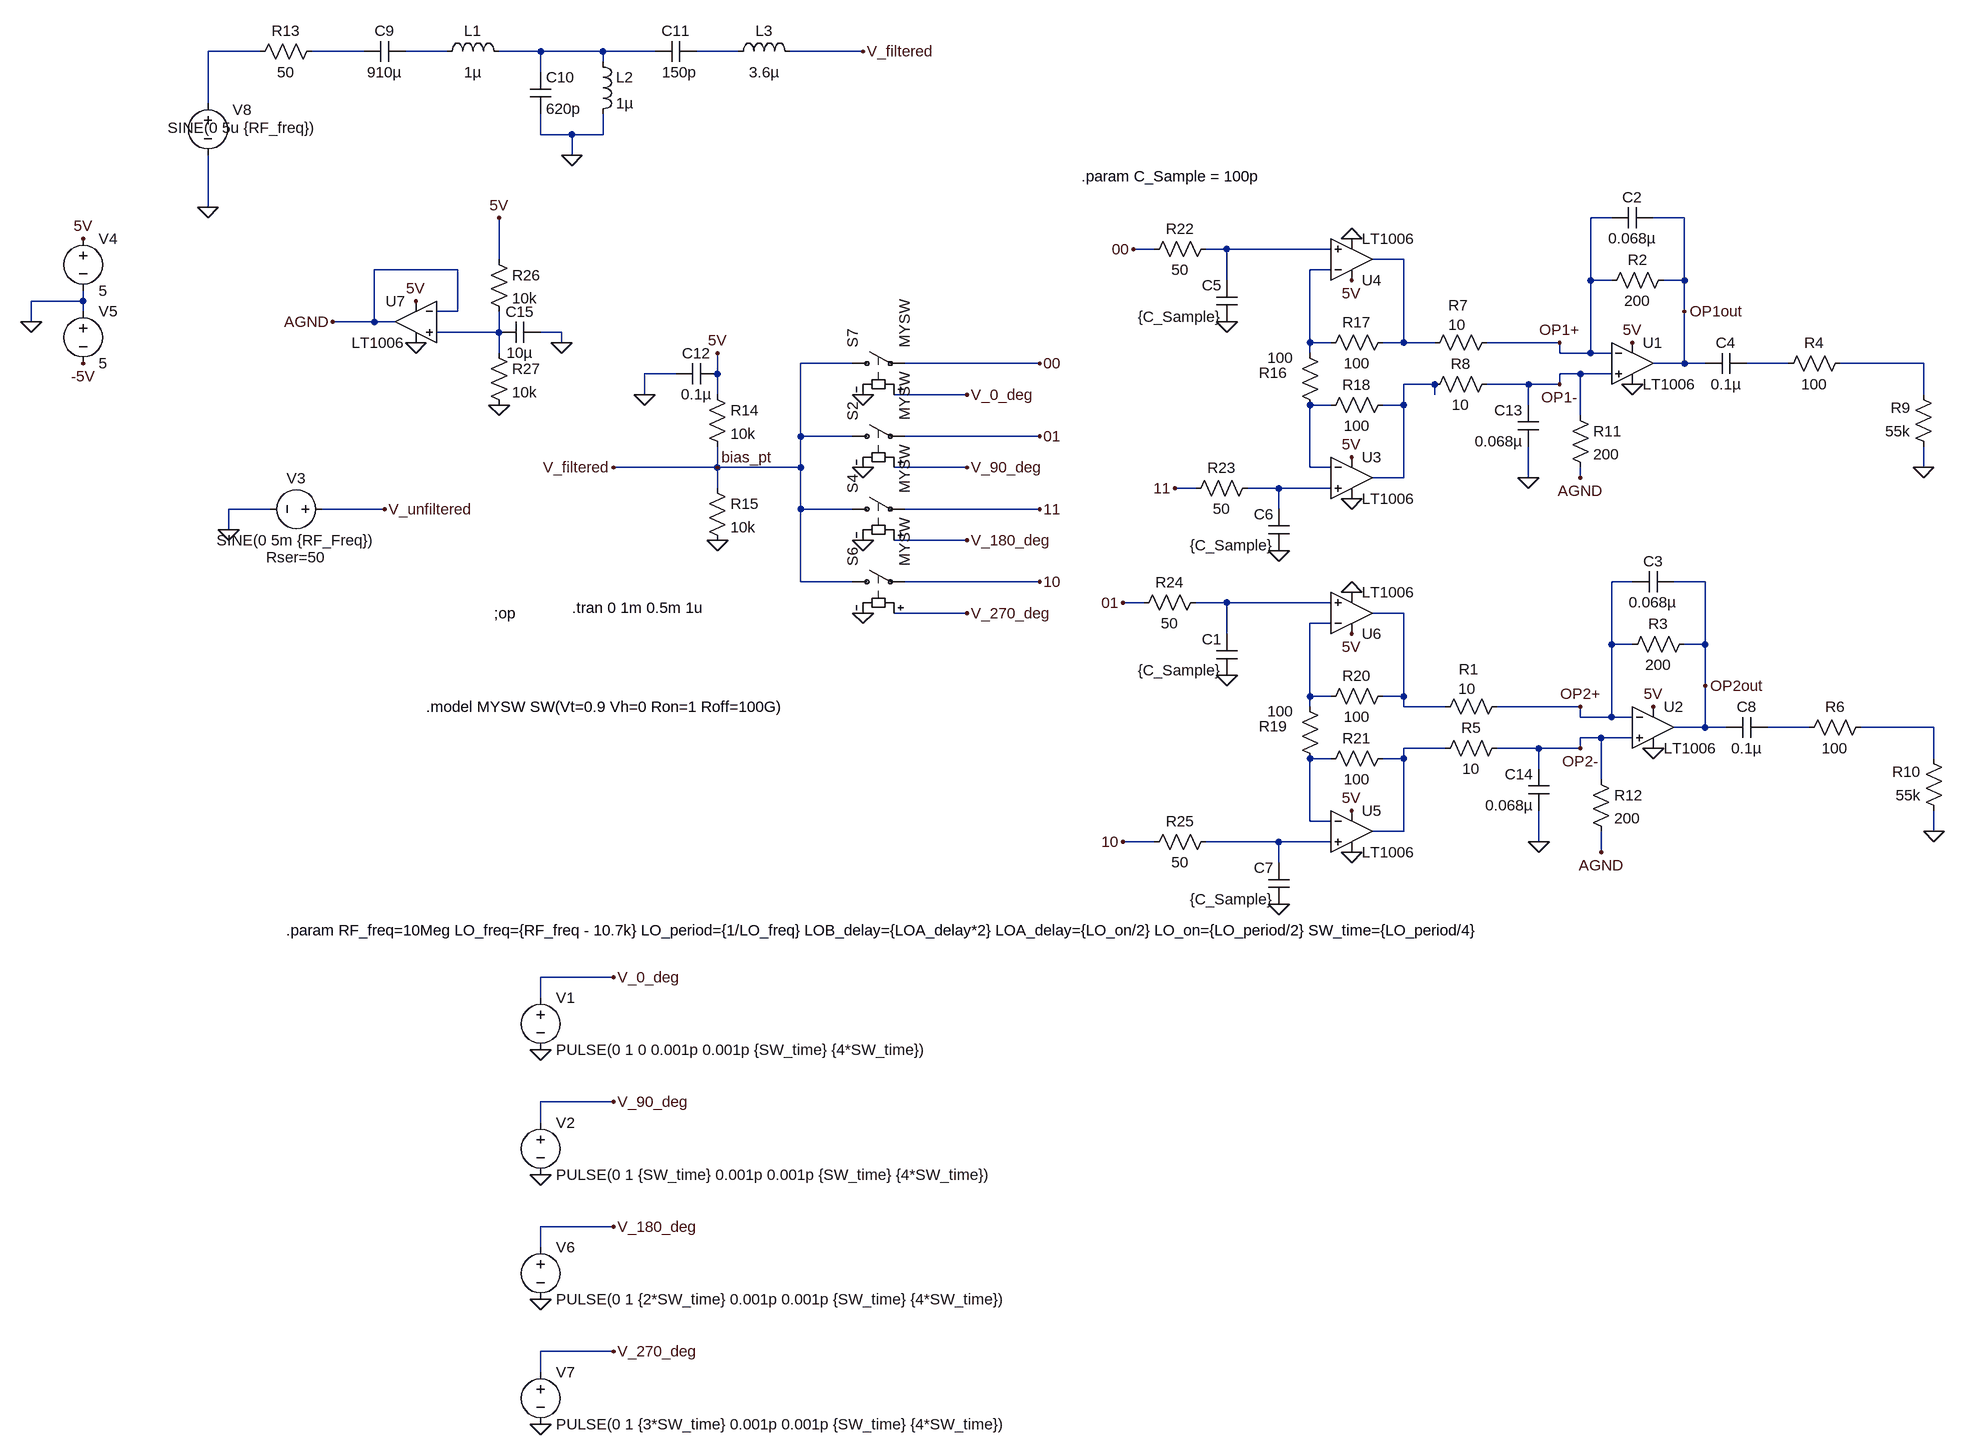
[diagram p0: schematic TayloeMixerSim.asc]
TayloeMixerSim.asc, the LTspice schematic file:
Version 4
SHEET 1 2720 1156
WIRE -784 -976 -864 -976
WIRE -624 -976 -704 -976
WIRE -496 -976 -560 -976
WIRE -352 -976 -416 -976
WIRE -256 -976 -352 -976
WIRE -176 -976 -256 -976
WIRE -48 -976 -112 -976
WIRE 144 -976 32 -976
WIRE -256 -960 -256 -976
WIRE -352 -944 -352 -976
WIRE -864 -896 -864 -976
WIRE -352 -848 -352 -880
WIRE -304 -848 -352 -848
WIRE -256 -848 -256 -880
WIRE -256 -848 -304 -848
WIRE -304 -816 -304 -848
WIRE -864 -736 -864 -816
WIRE 1296 -720 1264 -720
WIRE 1408 -720 1360 -720
WIRE 592 -672 560 -672
WIRE 704 -672 672 -672
WIRE 864 -672 704 -672
WIRE -416 -656 -416 -720
WIRE 976 -656 928 -656
WIRE -480 -640 -608 -640
WIRE 864 -640 832 -640
WIRE 704 -624 704 -672
WIRE 1264 -624 1264 -720
WIRE 1296 -624 1264 -624
WIRE 1408 -624 1408 -720
WIRE 1408 -624 1376 -624
WIRE -1056 -592 -1056 -608
WIRE -1056 -592 -1136 -592
WIRE -1056 -576 -1056 -592
WIRE -480 -576 -480 -640
WIRE -480 -576 -512 -576
WIRE 1408 -576 1408 -624
WIRE -1136 -560 -1136 -592
WIRE -608 -560 -608 -640
WIRE -608 -560 -672 -560
WIRE -576 -560 -608 -560
WIRE -416 -544 -416 -576
WIRE -416 -544 -512 -544
WIRE -320 -544 -352 -544
WIRE -320 -528 -320 -544
WIRE 832 -528 832 -640
WIRE 864 -528 832 -528
WIRE 976 -528 976 -656
WIRE 976 -528 944 -528
WIRE 1024 -528 976 -528
WIRE 1216 -528 1104 -528
WIRE -416 -512 -416 -544
WIRE 832 -512 832 -528
WIRE 1216 -512 1216 -528
WIRE 1264 -512 1264 -624
WIRE 1264 -512 1216 -512
WIRE 1296 -512 1264 -512
WIRE 128 -496 48 -496
WIRE 416 -496 208 -496
WIRE 1408 -496 1408 -576
WIRE 1408 -496 1360 -496
WIRE 1440 -496 1408 -496
WIRE 1568 -496 1504 -496
WIRE 1776 -496 1648 -496
WIRE -144 -480 -192 -480
WIRE -80 -480 -80 -512
WIRE 1248 -480 1216 -480
WIRE 1296 -480 1248 -480
WIRE 1024 -464 976 -464
WIRE 1168 -464 1104 -464
WIRE 1216 -464 1216 -480
WIRE 1216 -464 1168 -464
WIRE -192 -448 -192 -480
WIRE -80 -448 -80 -480
WIRE 304 -448 192 -448
WIRE 1024 -448 1024 -464
WIRE 1776 -448 1776 -496
WIRE 864 -432 832 -432
WIRE 976 -432 976 -464
WIRE 976 -432 944 -432
WIRE 1168 -432 1168 -464
WIRE 1248 -416 1248 -480
WIRE 48 -384 48 -496
WIRE 128 -384 48 -384
WIRE 416 -384 208 -384
WIRE -80 -336 -80 -368
WIRE -80 -336 -240 -336
WIRE 48 -336 48 -384
WIRE 48 -336 -80 -336
WIRE 304 -336 192 -336
WIRE 832 -336 832 -432
WIRE 864 -336 832 -336
WIRE 1776 -336 1776 -368
WIRE 976 -320 976 -432
WIRE 976 -320 928 -320
WIRE 1168 -320 1168 -368
WIRE 1248 -320 1248 -336
WIRE -80 -304 -80 -336
WIRE 656 -304 624 -304
WIRE 784 -304 736 -304
WIRE 864 -304 784 -304
WIRE -768 -272 -832 -272
WIRE -592 -272 -688 -272
WIRE 48 -272 48 -336
WIRE 128 -272 48 -272
WIRE 416 -272 208 -272
WIRE 784 -272 784 -304
WIRE -832 -240 -832 -272
WIRE 304 -224 192 -224
WIRE 48 -160 48 -272
WIRE 128 -160 48 -160
WIRE 416 -160 208 -160
WIRE 1328 -160 1296 -160
WIRE 1440 -160 1392 -160
WIRE 576 -128 544 -128
WIRE 704 -128 656 -128
WIRE 864 -128 704 -128
WIRE 304 -112 192 -112
WIRE 976 -112 928 -112
WIRE 864 -96 832 -96
WIRE 704 -80 704 -128
WIRE 1296 -64 1296 -160
WIRE 1328 -64 1296 -64
WIRE 1440 -64 1440 -160
WIRE 1440 -64 1408 -64
WIRE 1440 0 1440 -64
WIRE 832 16 832 -96
WIRE 864 16 832 16
WIRE 976 16 976 -112
WIRE 976 16 944 16
WIRE 832 32 832 16
WIRE 976 32 976 16
WIRE 1040 32 976 32
WIRE 1248 32 1120 32
WIRE 1248 48 1248 32
WIRE 1296 48 1296 -64
WIRE 1296 48 1248 48
WIRE 1328 48 1296 48
WIRE 1440 64 1440 0
WIRE 1440 64 1392 64
WIRE 1472 64 1440 64
WIRE 1600 64 1536 64
WIRE 1792 64 1680 64
WIRE 1280 80 1248 80
WIRE 1328 80 1280 80
WIRE 1040 96 976 96
WIRE 1184 96 1120 96
WIRE 1248 96 1248 80
WIRE 1248 96 1184 96
WIRE 864 112 832 112
WIRE 976 112 976 96
WIRE 976 112 944 112
WIRE 1792 112 1792 64
WIRE 1184 128 1184 96
WIRE 1280 144 1280 80
WIRE 832 208 832 112
WIRE 864 208 832 208
WIRE 976 224 976 112
WIRE 976 224 928 224
WIRE 1792 224 1792 192
WIRE 592 240 544 240
WIRE 784 240 672 240
WIRE 864 240 784 240
WIRE 1184 240 1184 192
WIRE 1280 256 1280 224
WIRE 784 272 784 240
WIRE -240 448 -352 448
WIRE -352 480 -352 448
WIRE -240 640 -352 640
WIRE -352 672 -352 640
WIRE -240 832 -352 832
WIRE -352 864 -352 832
WIRE -240 1024 -352 1024
WIRE -352 1056 -352 1024
FLAG 144 -448 0
FLAG 144 -336 0
FLAG 144 -224 0
FLAG 144 -112 0
FLAG -832 -240 0
FLAG -1056 -688 5V
FLAG 784 -208 0
FLAG 704 -560 0
FLAG 1216 -528 OP1+
FLAG 1248 96 OP2-
FLAG 1216 -464 OP1-
FLAG 1408 -576 OP1out
FLAG 1440 0 OP2out
FLAG 1248 32 OP2+
FLAG 1776 -336 0
FLAG 1792 224 0
FLAG -1136 -560 0
FLAG -1056 -496 -5V
FLAG 304 -448 V_0_deg
FLAG 304 -336 V_90_deg
FLAG 304 -224 V_180_deg
FLAG 304 -112 V_270_deg
FLAG -352 560 0
FLAG -240 448 V_0_deg
FLAG -352 752 0
FLAG -240 640 V_90_deg
FLAG -352 944 0
FLAG -240 832 V_180_deg
FLAG -352 1136 0
FLAG -240 1024 V_270_deg
FLAG 416 -496 00
FLAG 416 -272 11
FLAG 560 -672 00
FLAG 624 -304 11
FLAG -864 -736 0
FLAG -304 -816 0
FLAG 144 -976 V_filtered
FLAG -592 -272 V_unfiltered
FLAG -240 -336 V_filtered
FLAG -80 -512 5V
FLAG -80 -224 0
FLAG -80 -336 bias_pt
FLAG -192 -448 0
FLAG 1328 -464 0
FLAG 1328 -528 5V
FLAG 896 -624 5V
FLAG 896 -688 0
FLAG 896 -288 0
FLAG 896 -352 5V
FLAG 784 336 0
FLAG 704 -16 0
FLAG 544 -128 01
FLAG 544 240 10
FLAG 896 -80 5V
FLAG 896 -144 0
FLAG 896 256 0
FLAG 896 192 5V
FLAG 416 -384 01
FLAG 416 -160 10
FLAG 1168 -320 0
FLAG 1184 240 0
FLAG 1360 96 0
FLAG 1360 32 5V
FLAG -416 -720 5V
FLAG -416 -432 0
FLAG -320 -528 0
FLAG -672 -560 AGND
FLAG 1248 -320 AGND
FLAG 1280 256 AGND
FLAG -544 -528 0
FLAG -544 -592 5V
SYMBOL sw 112 -496 R270
SYMATTR InstName S7
SYMATTR Value MYSW
SYMBOL sw 112 -384 R270
SYMATTR InstName S2
SYMATTR Value MYSW
SYMBOL sw 112 -272 R270
SYMATTR InstName S4
SYMATTR Value MYSW
SYMBOL sw 112 -160 R270
SYMATTR InstName S6
SYMATTR Value MYSW
SYMBOL voltage -672 -272 R90
WINDOW 0 -32 56 VBottom 2
WINDOW 3 32 56 VTop 2
WINDOW 123 0 0 Left 0
WINDOW 39 90 56 VBottom 2
SYMATTR InstName V3
SYMATTR Value SINE(0 5m {RF_Freq})
SYMATTR SpiceLine Rser=50
SYMBOL voltage -1056 -704 R0
WINDOW 123 0 0 Left 0
WINDOW 39 0 0 Left 0
SYMATTR InstName V4
SYMATTR Value 5
SYMBOL cap 720 -560 R180
WINDOW 0 24 56 Left 2
WINDOW 3 24 8 Left 2
SYMATTR InstName C5
SYMATTR Value {C_Sample}
SYMBOL cap 800 -208 R180
WINDOW 0 24 56 Left 2
WINDOW 3 24 8 Left 2
SYMATTR InstName C6
SYMATTR Value {C_Sample}
SYMBOL res 1008 -512 R270
WINDOW 0 58 52 VTop 2
WINDOW 3 59 50 VBottom 2
SYMATTR InstName R7
SYMATTR Value 10
SYMBOL res 1120 -480 R90
WINDOW 0 0 56 VBottom 2
WINDOW 3 32 56 VTop 2
SYMATTR InstName R8
SYMATTR Value 10
SYMBOL res 1392 -640 R90
WINDOW 0 0 56 VBottom 2
WINDOW 3 32 56 VTop 2
SYMATTR InstName R2
SYMATTR Value 200
SYMBOL cap 1360 -736 R90
WINDOW 0 0 32 VBottom 2
WINDOW 3 32 32 VTop 2
SYMATTR InstName C2
SYMATTR Value 0.068µ
SYMBOL res 1424 -80 R90
WINDOW 0 0 56 VBottom 2
WINDOW 3 32 56 VTop 2
SYMATTR InstName R3
SYMATTR Value 200
SYMBOL cap 1392 -176 R90
WINDOW 0 0 32 VBottom 2
WINDOW 3 32 32 VTop 2
SYMATTR InstName C3
SYMATTR Value 0.068µ
SYMBOL cap 1504 -512 R90
WINDOW 0 0 32 VBottom 2
WINDOW 3 32 32 VTop 2
SYMATTR InstName C4
SYMATTR Value 0.1µ
SYMBOL cap 1536 48 R90
WINDOW 0 0 32 VBottom 2
WINDOW 3 32 32 VTop 2
SYMATTR InstName C8
SYMATTR Value 0.1µ
SYMBOL res 1664 -512 R90
WINDOW 0 0 56 VBottom 2
WINDOW 3 32 56 VTop 2
SYMATTR InstName R4
SYMATTR Value 100
SYMBOL res 1696 48 R90
WINDOW 0 0 56 VBottom 2
WINDOW 3 32 56 VTop 2
SYMATTR InstName R6
SYMATTR Value 100
SYMBOL res 1792 -352 R180
WINDOW 0 36 76 Left 2
WINDOW 3 36 40 Left 2
SYMATTR InstName R9
SYMATTR Value 55k
SYMBOL res 1808 208 R180
WINDOW 0 36 76 Left 2
WINDOW 3 36 40 Left 2
SYMATTR InstName R10
SYMATTR Value 55k
SYMBOL voltage -1056 -592 R0
WINDOW 123 0 0 Left 0
WINDOW 39 0 0 Left 0
SYMATTR InstName V5
SYMATTR Value 5
SYMBOL res 1232 -432 R0
SYMATTR InstName R11
SYMATTR Value 200
SYMBOL res 1264 128 R0
SYMATTR InstName R12
SYMATTR Value 200
SYMBOL voltage -352 464 R0
WINDOW 123 0 0 Left 0
WINDOW 39 0 0 Left 0
SYMATTR InstName V1
SYMATTR Value PULSE(0 1 0 0.001p 0.001p {SW_time} {4*SW_time})
SYMBOL voltage -352 656 R0
WINDOW 123 0 0 Left 0
WINDOW 39 0 0 Left 0
SYMATTR InstName V2
SYMATTR Value PULSE(0 1 {SW_time} 0.001p 0.001p {SW_time} {4*SW_time})
SYMBOL voltage -352 848 R0
WINDOW 123 0 0 Left 0
WINDOW 39 0 0 Left 0
SYMATTR InstName V6
SYMATTR Value PULSE(0 1 {2*SW_time} 0.001p 0.001p {SW_time} {4*SW_time})
SYMBOL voltage -352 1040 R0
WINDOW 123 0 0 Left 0
WINDOW 39 0 0 Left 0
SYMATTR InstName V7
SYMATTR Value PULSE(0 1 {3*SW_time} 0.001p 0.001p {SW_time} {4*SW_time})
SYMBOL voltage -864 -912 R0
WINDOW 0 53 41 Bottom 2
WINDOW 3 53 69 Bottom 2
WINDOW 123 0 0 Left 0
WINDOW 39 60 56 VTop 2
SYMATTR InstName V8
SYMATTR Value SINE(0 5u {RF_freq})
SYMBOL cap -560 -992 R90
WINDOW 0 0 32 VBottom 2
WINDOW 3 32 32 VTop 2
SYMATTR InstName C9
SYMATTR Value 910µ
SYMBOL ind -512 -960 R270
WINDOW 0 32 56 VTop 2
WINDOW 3 0 56 VBottom 2
SYMATTR InstName L1
SYMATTR Value 1µ
SYMBOL cap -368 -944 R0
SYMATTR InstName C10
SYMATTR Value 620p
SYMBOL ind -272 -976 R0
SYMATTR InstName L2
SYMATTR Value 1µ
SYMBOL cap -112 -992 R90
WINDOW 0 0 32 VBottom 2
WINDOW 3 32 26 VTop 2
SYMATTR InstName C11
SYMATTR Value 150p
SYMBOL ind -64 -960 R270
WINDOW 0 32 56 VTop 2
WINDOW 3 0 56 VBottom 2
SYMATTR InstName L3
SYMATTR Value 3.6µ
SYMBOL res -688 -992 R90
WINDOW 0 0 56 VBottom 2
WINDOW 3 32 56 VTop 2
SYMATTR InstName R13
SYMATTR Value 50
SYMBOL res -96 -464 R0
SYMATTR InstName R14
SYMATTR Value 10k
SYMBOL res -96 -320 R0
SYMATTR InstName R15
SYMATTR Value 10k
SYMBOL cap -80 -496 R90
WINDOW 0 0 32 VBottom 2
WINDOW 3 32 32 VTop 2
SYMATTR InstName C12
SYMATTR Value 0.1µ
SYMBOL Opamps\\LT1006 1328 -560 R0
SYMATTR InstName U1
SYMBOL Opamps\\LT1006 896 -384 R0
SYMATTR InstName U3
SYMBOL Opamps\\LT1006 896 -592 M180
SYMATTR InstName U4
SYMBOL res 816 -528 R0
WINDOW 0 -63 46 Left 2
WINDOW 3 -50 23 Left 2
SYMATTR InstName R16
SYMATTR Value 100
SYMBOL res 960 -544 R90
WINDOW 0 0 56 VBottom 2
WINDOW 3 32 56 VTop 2
SYMATTR InstName R17
SYMATTR Value 100
SYMBOL res 960 -448 R90
WINDOW 0 0 56 VBottom 2
WINDOW 3 32 56 VTop 2
SYMATTR InstName R18
SYMATTR Value 100
SYMBOL cap 720 -16 R180
WINDOW 0 24 56 Left 2
WINDOW 3 24 8 Left 2
SYMATTR InstName C1
SYMATTR Value {C_Sample}
SYMBOL cap 800 336 R180
WINDOW 0 24 56 Left 2
WINDOW 3 24 8 Left 2
SYMATTR InstName C7
SYMATTR Value {C_Sample}
SYMBOL Opamps\\LT1006 896 160 R0
SYMATTR InstName U5
SYMBOL Opamps\\LT1006 896 -48 M180
SYMATTR InstName U6
SYMBOL res 816 16 R0
WINDOW 0 -63 46 Left 2
WINDOW 3 -50 23 Left 2
SYMATTR InstName R19
SYMATTR Value 100
SYMBOL res 960 0 R90
WINDOW 0 0 56 VBottom 2
WINDOW 3 32 56 VTop 2
SYMATTR InstName R20
SYMATTR Value 100
SYMBOL res 960 96 R90
WINDOW 0 0 56 VBottom 2
WINDOW 3 32 56 VTop 2
SYMATTR InstName R21
SYMATTR Value 100
SYMBOL cap 1184 -368 R180
WINDOW 0 24 56 Left 2
WINDOW 3 24 8 Left 2
SYMATTR InstName C13
SYMATTR Value 0.068µ
SYMBOL res 1024 48 R270
WINDOW 0 58 52 VTop 2
WINDOW 3 59 50 VBottom 2
SYMATTR InstName R1
SYMATTR Value 10
SYMBOL res 1136 80 R90
WINDOW 0 0 56 VBottom 2
WINDOW 3 32 56 VTop 2
SYMATTR InstName R5
SYMATTR Value 10
SYMBOL cap 1200 192 R180
WINDOW 0 24 56 Left 2
WINDOW 3 24 8 Left 2
SYMATTR InstName C14
SYMATTR Value 0.068µ
SYMBOL res 688 -688 R90
WINDOW 0 0 56 VBottom 2
WINDOW 3 32 56 VTop 2
SYMATTR InstName R22
SYMATTR Value 50
SYMBOL res 752 -320 R90
WINDOW 0 0 56 VBottom 2
WINDOW 3 32 56 VTop 2
SYMATTR InstName R23
SYMATTR Value 50
SYMBOL res 672 -144 R90
WINDOW 0 0 56 VBottom 2
WINDOW 3 32 56 VTop 2
SYMATTR InstName R24
SYMATTR Value 50
SYMBOL res 688 224 R90
WINDOW 0 0 56 VBottom 2
WINDOW 3 32 56 VTop 2
SYMATTR InstName R25
SYMATTR Value 50
SYMBOL Opamps\\LT1006 1360 0 R0
SYMATTR InstName U2
SYMBOL res -432 -672 R0
SYMATTR InstName R26
SYMATTR Value 10k
SYMBOL res -432 -528 R0
SYMATTR InstName R27
SYMATTR Value 10k
SYMBOL cap -416 -528 R270
WINDOW 0 32 32 VTop 2
WINDOW 3 0 32 VBottom 2
SYMATTR InstName C15
SYMATTR Value 10µ
SYMBOL Opamps\\LT1006 -544 -624 M0
SYMATTR InstName U7
TEXT -528 32 Left 2 !.model MYSW SW(Vt=0.9 Vh=0 Ron=1 Roff=100G)
TEXT -304 -120 Left 2 !.tran 0 1m 0.5m 1u
TEXT -744 376 Left 2 !.param RF_freq=10Meg LO_freq={RF_freq - 10.7k} LO_period={1/LO_freq} LOB_delay={LOA_delay*2} LOA_delay={LO_on/2} LO_on={LO_period/2} SW_time={LO_period/4}
TEXT -424 -112 Left 2 !;op
TEXT 480 -784 Left 2 !.param C_Sample = 100p

The netlist it stands for:
* TayloeMixerSim.asc
S7 bias_pt 00 V_0_deg 0 MYSW
S2 bias_pt 01 V_90_deg 0 MYSW
S4 bias_pt 11 V_180_deg 0 MYSW
S6 bias_pt 10 V_270_deg 0 MYSW
V3 V_unfiltered 0 SINE(0 5m {RF_Freq}) Rser=50
V4 5V 0 5
C5 0 N006 {C_Sample}
C6 0 N014 {C_Sample}
R7 N007 OP1+ 10
R8 OP1- N012 10
R2 OP1out OP1+ 200
C2 OP1out OP1+ 0.068µ
R3 OP2out OP2+ 200
C3 OP2out OP2+ 0.068µ
C4 N010 OP1out 0.1µ
C8 N018 OP2out 0.1µ
R4 N011 N010 100
R6 N019 N018 100
R9 0 N011 55k
R10 0 N019 55k
V5 0 -5V 5
R11 OP1- AGND 200
R12 OP2- AGND 200
V1 V_0_deg 0 PULSE(0 1 0 0.001p 0.001p {SW_time} {4*SW_time})
V2 V_90_deg 0 PULSE(0 1 {SW_time} 0.001p 0.001p {SW_time} {4*SW_time})
V6 V_180_deg 0 PULSE(0 1 {2*SW_time} 0.001p 0.001p {SW_time} {4*SW_time})
V7 V_270_deg 0 PULSE(0 1 {3*SW_time} 0.001p 0.001p {SW_time} {4*SW_time})
V8 N001 0 SINE(0 5u {RF_freq})
C9 N003 N002 910µ
L1 N003 N004 1µ
C10 N004 0 620p
L2 N004 0 1µ
C11 N005 N004 150p
L3 N005 bias_pt 3.6µ
R13 N002 N001 50
R14 5V bias_pt 10k
R15 bias_pt 0 10k
C12 5V 0 0.1µ
XU1 OP1- OP1+ 5V 0 OP1out LT1006  ; pins In+ In- V+ V- OUT
XU3 N014 N013 5V 0 N012 LT1006  ; pins In+ In- V+ V- OUT
XU4 N006 N008 5V 0 N007 LT1006  ; pins In+ In- V+ V- OUT
R16 N008 N013 100
R17 N007 N008 100
R18 N012 N013 100
C1 0 N015 {C_Sample}
C7 0 N022 {C_Sample}
XU5 N022 N021 5V 0 N020 LT1006  ; pins In+ In- V+ V- OUT
XU6 N015 N017 5V 0 N016 LT1006  ; pins In+ In- V+ V- OUT
R19 N017 N021 100
R20 N016 N017 100
R21 N020 N021 100
C13 0 OP1- 0.068µ
R1 N016 OP2+ 10
R5 OP2- N020 10
C14 0 OP2- 0.068µ
R22 N006 00 50
R23 N014 11 50
R24 N015 01 50
R25 N022 10 50
XU2 OP2- OP2+ 5V 0 OP2out LT1006  ; pins In+ In- V+ V- OUT
R26 5V N009 10k
R27 N009 0 10k
C15 N009 0 10µ
XU7 N009 AGND 5V 0 AGND LT1006  ; pins In+ In- V+ V- OUT
.model MYSW SW(Vt=0.9 Vh=0 Ron=1 Roff=100G)
.tran 0 1m 0.5m 1u
.param RF_freq=10Meg LO_freq={RF_freq - 10.7k} LO_period={1/LO_freq} LOB_delay={LOA_delay*2} LOA_delay={LO_on/2} LO_on={LO_period/2} SW_time={LO_period/4}
;op
.param C_Sample = 100p
.lib LTC.lib
.backanno
.end